# Altium schematic sheet Ethernet.SchDoc
size A4; SheetNumber: 4; SheetTotal: 10
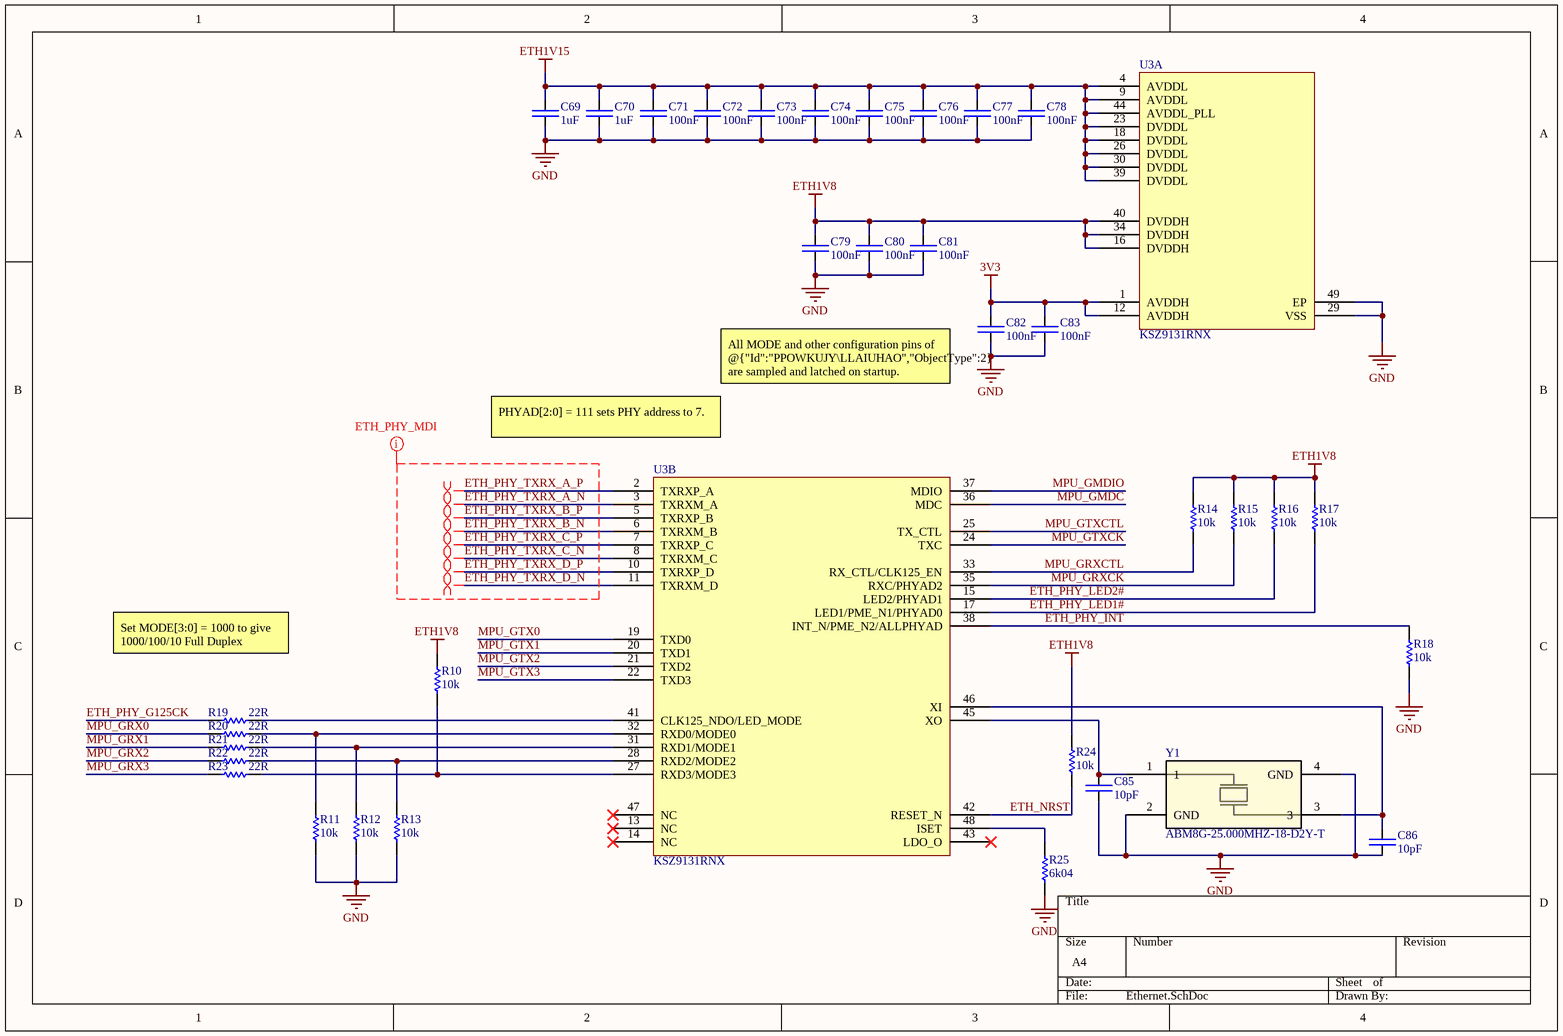
[diagram p0: Ethernet.SchDoc]

## Parts
C69  1uF  [CAP-0805]
C70  1uF  [CAP-0805]
C71  100nF  [CAP-0603]
C72  100nF  [CAP-0603]
C73  100nF  [CAP-0603]
C74  100nF  [CAP-0603]
C75  100nF  [CAP-0603]
C76  100nF  [CAP-0603]
C77  100nF  [CAP-0603]
C78  100nF  [CAP-0603]
C79  100nF  [CAP-0603]
C80  100nF  [CAP-0603]
C81  100nF  [CAP-0603]
C82  100nF  [CAP-0603]
C83  100nF  [CAP-0603]
C85  10pF  [CAP-0603]
C86  10pF  [CAP-0603]
R10  10k  [RES-0603]
R11  10k  [RES-0603]
R12  10k  [RES-0603]
R13  10k  [RES-0603]
R14  10k  [RES-0603]
R15  10k  [RES-0603]
R16  10k  [RES-0603]
R17  10k  [RES-0603]
R18  10k  [RES-0603]
R19  22R  [RES-0603]
R20  22R  [RES-0603]
R21  22R  [RES-0603]
R22  22R  [RES-0603]
R23  22R  [RES-0603]
R24  10k  [RES-0603]
R25  6k04  [RES-0603]
U3  KSZ9131RNX  [KSZ9131RNXC-TR]  (parts A,B of 2)
Y1  ABM8G-25.000MHZ-18-D2Y-T  [CRYSTAL_ABM8G_ABR]

## Nets
3V3: C82.2 C83.2 U3.1(AVDDH) U3.12(AVDDH)
ETH1V8: C79.2 C80.2 C81.2 R10.2 R14.2 R15.2 R16.2 R17.2 R24.2 U3.16(DVDDH) U3.34(DVDDH) U3.40(DVDDH)
ETH1V15: C69.2 C70.2 C71.2 C72.2 C73.2 C74.2 C75.2 C76.2 C77.2 C78.2 U3.4(AVDDL) U3.9(AVDDL) U3.18(DVDDL) U3.23(DVDDL) U3.26(DVDDL) U3.30(DVDDL) U3.39(DVDDL) U3.44(AVDDL_PLL)
GND: C69.1 C70.1 C71.1 C72.1 C73.1 C74.1 C75.1 C76.1 C77.1 C78.1 C79.1 C80.1 C81.1 C82.1 C83.1 C85.1 C86.1 R11.1 R12.1 R13.1 R18.1 R25.1 U3.29(VSS) U3.49(EP) Y1.2(GND) Y1.4(GND)
ETH_NRST: R24.1 U3.42(RESET_N)
ETH_PHY_G125CK: R19.2
ETH_PHY_INT: R18.2 U3.38(INT_N/PME_N2/ALLPHYAD)
ETH_PHY_LED1#: R17.1 U3.17(LED1/PME_N1/PHYAD0)
ETH_PHY_LED2#: R16.1 U3.15(LED2/PHYAD1)
ETH_PHY_TXRX_A_N: U3.3(TXRXM_A)
ETH_PHY_TXRX_A_P: U3.2(TXRXP_A)
ETH_PHY_TXRX_B_N: U3.6(TXRXM_B)
ETH_PHY_TXRX_B_P: U3.5(TXRXP_B)
ETH_PHY_TXRX_C_N: U3.8(TXRXM_C)
ETH_PHY_TXRX_C_P: U3.7(TXRXP_C)
ETH_PHY_TXRX_D_N: U3.11(TXRXM_D)
ETH_PHY_TXRX_D_P: U3.10(TXRXP_D)
MPU_GMDC: U3.36(MDC)
MPU_GMDIO: U3.37(MDIO)
MPU_GRX0: R20.2
MPU_GRX1: R21.2
MPU_GRX2: R22.2
MPU_GRX3: R23.2
MPU_GRXCK: R15.1 U3.35(RXC/PHYAD2)
MPU_GRXCTL: R14.1 U3.33(RX_CTL/CLK125_EN)
MPU_GTX0: U3.19(TXD0)
MPU_GTX1: U3.20(TXD1)
MPU_GTX2: U3.21(TXD2)
MPU_GTX3: U3.22(TXD3)
MPU_GTXCK: U3.24(TXC)
MPU_GTXCTL: U3.25(TX_CTL)
NetC85_2: C85.2 U3.45(XO) Y1.1
NetC86_2: C86.2 U3.46(XI) Y1.3
NetR10_1: R10.1 R23.1 U3.27(RXD3/MODE3)
NetR11_2: R11.2 R20.1 U3.32(RXD0/MODE0)
NetR12_2: R12.2 R21.1 U3.31(RXD1/MODE1)
NetR13_2: R13.2 R22.1 U3.28(RXD2/MODE2)
NetR19_1: R19.1 U3.41(CLK125_NDO/LED_MODE)
NetR25_2: R25.2 U3.48(ISET)

Not connected (* = marked no-connect by the designer): U3 13(NC)* 14(NC)* 43(LDO_O)* 47(NC)*

## Layout directives
differential pair: ETH_PHY_TXRX_A_N, ETH_PHY_TXRX_A_P, ETH_PHY_TXRX_B_N, ETH_PHY_TXRX_B_P, ETH_PHY_TXRX_C_N, ETH_PHY_TXRX_C_P, ETH_PHY_TXRX_D_N, ETH_PHY_TXRX_D_P
net class ETH_PHY_MDI_PAIRS: ETH_PHY_TXRX_A_N, ETH_PHY_TXRX_A_P, ETH_PHY_TXRX_B_N, ETH_PHY_TXRX_B_P, ETH_PHY_TXRX_C_N, ETH_PHY_TXRX_C_P, ETH_PHY_TXRX_D_N, ETH_PHY_TXRX_D_P

## Notes on the sheet
- (near C82) All MODE and other configuration pins of @{"Id":"PPOWKUJY\LLAIUHAO","ObjectType":2} are sampled and latched on startup.
- PHYAD[2:0] = 111 sets PHY address to 7.
- Set MODE[3:0] = 1000 to give 1000/100/10 Full Duplex

## Library data of the parts
C69 C70 = CAP-0805: Capacitor chip unpolarized. 0805
C71-C83 C85 C86 = CAP-0603: Capacitor chip unpolarized. 0603
R10-R25 = RES-0603: Resistor chip. 0603
U3 = KSZ9131RNX: Eth PHY Gigabit
Y1 = ABM8G-25.000MHZ-18-D2Y-T: Description; Manufacturer_Name: Abracon; Copyright: Copyright (C) 2026 Ultra Librarian. All rights reserved.; Manufacturer_Part_Number: ABM8G-25.000MHZ-18-D2Y-T; RefDes: RefDes; Type: Type